# EAGLE schematic VDC (EAGLE 6.4)
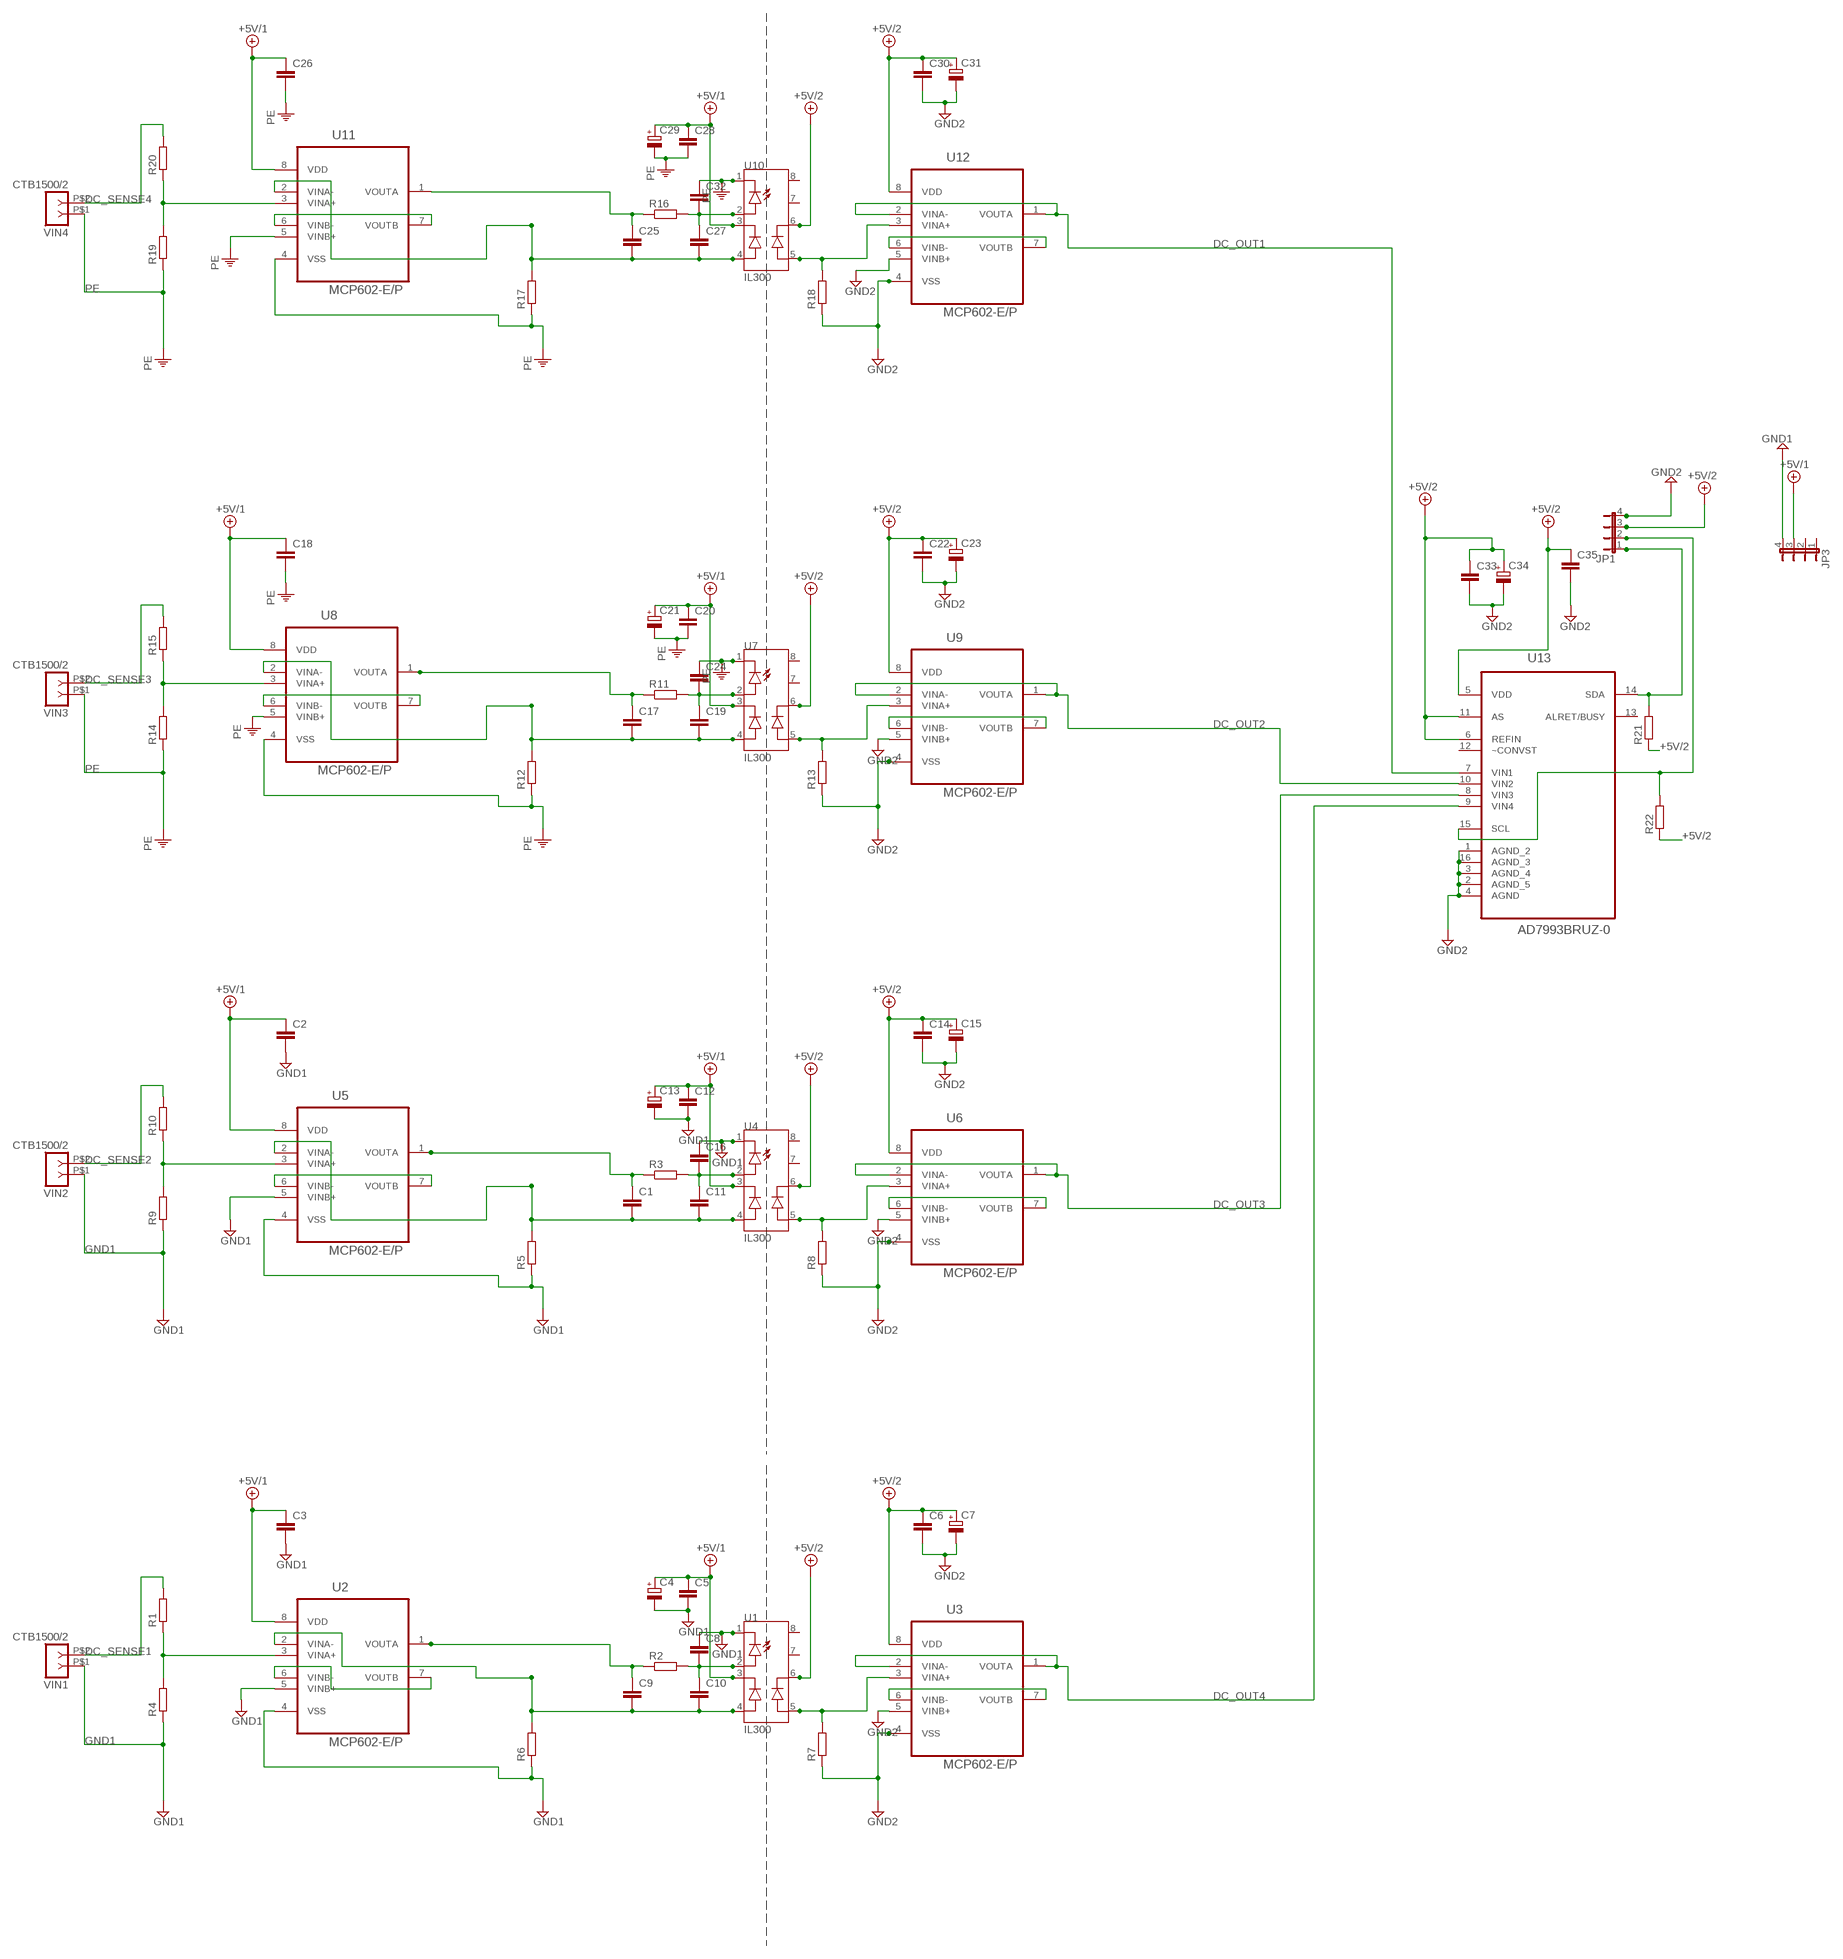
[diagram p0: schematic, sheet 1]

## Parts
C1  C-EU025-040X050  [C025-040X050]
C2  C-EU025-040X050  [C025-040X050]
C3  C-EU025-040X050  [C025-040X050]
C4  CPOL-EUE2-5  [E2-5]
C5  C-EU025-040X050  [C025-040X050]
C6  C-EU025-040X050  [C025-040X050]
C7  CPOL-EUE2-5  [E2-5]
C8  C-EU025-040X050  [C025-040X050]
C9  C-EU025-040X050  [C025-040X050]
C10  C-EU025-040X050  [C025-040X050]
C11  C-EU025-040X050  [C025-040X050]
C12  C-EU025-040X050  [C025-040X050]
C13  CPOL-EUE2-5  [E2-5]
C14  C-EU025-040X050  [C025-040X050]
C15  CPOL-EUE2-5  [E2-5]
C16  C-EU025-040X050  [C025-040X050]
C17  C-EU025-040X050  [C025-040X050]
C18  C-EU025-040X050  [C025-040X050]
C19  C-EU025-040X050  [C025-040X050]
C20  C-EU025-040X050  [C025-040X050]
C21  CPOL-EUE2-5  [E2-5]
C22  C-EU025-040X050  [C025-040X050]
C23  CPOL-EUE2-5  [E2-5]
C24  C-EU025-040X050  [C025-040X050]
C25  C-EU025-040X050  [C025-040X050]
C26  C-EU025-040X050  [C025-040X050]
C27  C-EU025-040X050  [C025-040X050]
C28  C-EU025-040X050  [C025-040X050]
C29  CPOL-EUE2-5  [E2-5]
C30  C-EU025-040X050  [C025-040X050]
C31  CPOL-EUE2-5  [E2-5]
C32  C-EU025-040X050  [C025-040X050]
C33  C-EU025-024X044  [C025-024X044]
C34  CPOL-EUE2-4  [E2-4]
C35  C-EU025-025X050  [C025-025X050]
JP1  JP4E  [JP4]
JP3  JP4E  [JP4]
R1  R-EU_0207/10  [0207/10]
R2  R-EU_0207/10  [0207/10]
R3  R-EU_0207/10  [0207/10]
R4  R-EU_0207/10  [0207/10]
R5  R-EU_0207/10  [0207/10]
R6  R-EU_0207/10  [0207/10]
R7  R-EU_0207/10  [0207/10]
R8  R-EU_0207/10  [0207/10]
R9  R-EU_0207/10  [0207/10]
R10  R-EU_0207/10  [0207/10]
R11  R-EU_0207/10  [0207/10]
R12  R-EU_0207/10  [0207/10]
R13  R-EU_0207/10  [0207/10]
R14  R-EU_0207/10  [0207/10]
R15  R-EU_0207/10  [0207/10]
R16  R-EU_0207/10  [0207/10]
R17  R-EU_0207/10  [0207/10]
R18  R-EU_0207/10  [0207/10]
R19  R-EU_0207/10  [0207/10]
R20  R-EU_0207/10  [0207/10]
R21  R-EU_0207/10  [0207/10]
R22  R-EU_0207/10  [0207/10]
U1  IL300  [DIL08]
U2  MCP602-E/P  [DIP254P762X508-8P]
U3  MCP602-E/P  [DIP254P762X508-8P]
U4  IL300  [DIL08]
U5  MCP602-E/P  [DIP254P762X508-8P]
U6  MCP602-E/P  [DIP254P762X508-8P]
U7  IL300  [DIL08]
U8  MCP602-E/P  [DIP254P762X508-8P]
U9  MCP602-E/P  [DIP254P762X508-8P]
U10  IL300  [DIL08]
U11  MCP602-E/P  [DIP254P762X508-8P]
U12  MCP602-E/P  [DIP254P762X508-8P]
U13  AD7993BRUZ-0  [SOP65P640X120-16N]
VIN1  CTB1500/2  [CTB1500-2]
VIN2  CTB1500/2  [CTB1500-2]
VIN3  CTB1500/2  [CTB1500-2]
VIN4  CTB1500/2  [CTB1500-2]

## Nets
+5V/1: C2.1 C3.1 C4.+ C5.1 C12.1 C13.+ C18.1 C20.1 C21.+ C26.1 C28.1 C29.+ JP3.3 U1.3(C_FB) U2.8(VDD) U4.3(C_FB) U5.8(VDD) U7.3(C_FB) U8.8(VDD) U10.3(C_FB) U11.8(VDD)
+5V/2: C6.1 C7.+ C14.1 C15.+ C22.1 C23.+ C30.1 C31.+ C33.1 C34.+ C35.1 JP1.3 R21.1 R22.1 U1.6(C_OUT) U3.8(VDD) U4.6(C_OUT) U6.8(VDD) U7.6(C_OUT) U9.8(VDD) U10.6(C_OUT) U12.8(VDD) U13.5(VDD) U13.6(REFIN) U13.11(AS)
DC_OUT1: U12.1(VOUTA) U12.2(VINA-) U13.7(VIN1)
DC_OUT2: U9.1(VOUTA) U9.2(VINA-) U13.10(VIN2)
DC_OUT3: U6.1(VOUTA) U6.2(VINA-) U13.8(VIN3)
DC_OUT4: U3.1(VOUTA) U3.2(VINA-) U13.9(VIN4)
DC_SENSE1: R1.2 VIN1.P$2
DC_SENSE2: R10.2 VIN2.P$2
DC_SENSE3: R15.2 VIN3.P$2
DC_SENSE4: R20.2 VIN4.P$2
GND1: C2.2 C3.2 C4.- C5.2 C8.1 C12.2 C13.- C16.1 JP3.4 R4.1 R5.1 R6.1 R9.1 U1.1(C_LED) U2.4(VSS) U2.5(VINB+) U4.1(C_LED) U5.4(VSS) U5.5(VINB+) VIN1.P$1 VIN2.P$1
GND2: C6.2 C7.- C14.2 C15.- C22.2 C23.- C30.2 C31.- C33.2 C34.- C35.2 JP1.4 R7.1 R8.1 R13.1 R18.1 U3.4(VSS) U3.5(VINB+) U6.4(VSS) U6.5(VINB+) U9.4(VSS) U9.5(VINB+) U12.4(VSS) U12.5(VINB+) U13.1(AGND_2) U13.2(AGND_5) U13.3(AGND_4) U13.4(AGND) U13.16(AGND_3)
N$1: C9.2 C10.2 R6.2 U1.4(A_FB) U2.2(VINA-)
N$2: C1.2 C11.2 R5.2 U4.4(A_FB) U5.2(VINA-)
N$3: R7.2 U1.5(A_OUT) U3.3(VINA+)
N$4: C8.2 C10.1 R2.2 U1.2(A_LED)
N$5: C9.1 R2.1 U2.1(VOUTA)
N$6: C11.1 C16.2 R3.2 U4.2(A_LED)
N$7: C1.1 R3.1 U5.1(VOUTA)
N$8: R1.1 R4.2 U2.3(VINA+)
N$9: R8.2 U4.5(A_OUT) U6.3(VINA+)
N$10: R9.2 R10.1 U5.3(VINA+)
N$11: C17.2 C19.2 R12.2 U7.4(A_FB) U8.2(VINA-)
N$12: C19.1 C24.2 R11.2 U7.2(A_LED)
N$13: C17.1 R11.1 U8.1(VOUTA)
N$14: R13.2 U7.5(A_OUT) U9.3(VINA+)
N$15: R14.2 R15.1 U8.3(VINA+)
N$16: C25.2 C27.2 R17.2 U10.4(A_FB) U11.2(VINA-)
N$17: C27.1 C32.2 R16.2 U10.2(A_LED)
N$18: C25.1 R16.1 U11.1(VOUTA)
N$19: R18.2 U10.5(A_OUT) U12.3(VINA+)
N$20: R19.2 R20.1 U11.3(VINA+)
N$21: JP1.1 R21.2 U13.14(SDA)
N$22: JP1.2 R22.2 U13.15(SCL)
N$25: U11.6(VINB-) U11.7(VOUTB)
N$27: U12.6(VINB-) U12.7(VOUTB)
N$28: U8.6(VINB-) U8.7(VOUTB)
N$31: U9.6(VINB-) U9.7(VOUTB)
N$32: U5.6(VINB-) U5.7(VOUTB)
N$34: U6.6(VINB-) U6.7(VOUTB)
N$36: U2.6(VINB-) U2.7(VOUTB)
N$38: U3.6(VINB-) U3.7(VOUTB)
PE: C18.2 C20.2 C21.- C24.1 C26.2 C28.2 C29.- C32.1 R12.1 R14.1 R17.1 R19.1 U7.1(C_LED) U8.4(VSS) U8.5(VINB+) U10.1(C_LED) U11.4(VSS) U11.5(VINB+) VIN3.P$1 VIN4.P$1
Unconnected: JP3.1 JP3.2 U1.7(PIN7) U1.8(PIN8) U4.7(PIN7) U4.8(PIN8) U7.7(PIN7) U7.8(PIN8) U10.7(PIN7) U10.8(PIN8) U13.12(~CONVST) U13.13(ALRET/BUSY)

## Library data of the parts
C1-C3 C5 C6 C8-C12 C14 C16-C20 C22 C24-C28 C30 C32 C33 C35 = resistor:C-EU: CAPACITOR, European symbol
C4 C7 C13 C15 C21 C23 C29 C31 C34 = resistor:CPOL-EU: POLARIZED CAPACITOR, European symbol
JP1 JP3 = jumper:JP4E: JUMPER
R1-R22 = resistor:R-EU_: RESISTOR, European symbol
U1 U4 U7 U10 = ic-optoisolator:IL300
U2 U3 U5 U6 U8 U9 U11 U12 = MCP:MCP602-E/P: IC, 2.7V to 5.5V Single-Supply CMOS Dual Op Amps,DIP-8; MPN: MCP602-E/P; OC_FARNELL: 1852042; OC_NEWARK: 88H9870; PACKAGE: DIP-8; SUPPLIER: Microchip
U13 = ADC:AD7993BRUZ-0: ADC; MPN: AD7993BRUZ-0; OC_FARNELL: 1078309; OC_NEWARK: 59K6101; PACKAGE: TSSOP-16; SUPPLIER: Analog Devices
VIN1-VIN4 = eko-parts:CTB1500/2